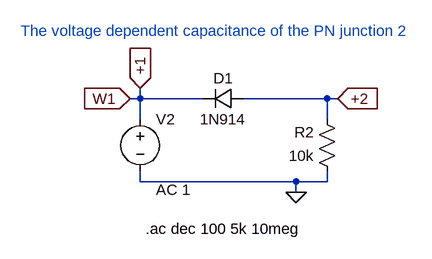
[diagram p0: schematic v_dep_pn2.asc]
v_dep_pn2.asc, the LTspice schematic file:
Version 4
SHEET 1 880 680
WIRE 128 96 128 80
WIRE 128 96 112 96
WIRE 224 96 128 96
WIRE 416 96 288 96
WIRE 432 96 416 96
WIRE 128 128 128 96
WIRE 416 128 416 96
WIRE 128 224 128 208
WIRE 368 224 128 224
WIRE 416 224 416 208
WIRE 416 224 368 224
WIRE 368 240 368 224
FLAG 368 240 0
FLAG 112 96 W1
IOPIN 112 96 In
FLAG 128 80 +1
IOPIN 128 80 In
FLAG 432 96 +2
IOPIN 432 96 In
SYMBOL res 432 224 R180
WINDOW 0 36 76 Left 2
WINDOW 3 36 40 Left 2
SYMATTR InstName R2
SYMATTR Value 10k
SYMBOL voltage 128 112 R0
WINDOW 123 24 124 Left 2
WINDOW 39 0 0 Left 0
SYMATTR Value2 AC 1
SYMATTR InstName V2
SYMATTR Value ""
SYMBOL diode 288 80 R90
WINDOW 0 0 32 VBottom 2
WINDOW 3 32 32 VTop 2
SYMATTR InstName D1
SYMATTR Value 1N914
TEXT 136 296 Left 2 !.ac dec 100 5k 10meg
TEXT -56 -8 Left 2 ;The voltage dependent capacitance of the PN junction 2

The netlist it stands for:
* v_dep_pn2.asc
R2 0 +2 10k
V2 +1 0 AC 1
D1 +2 +1 1N914
.model D D
.lib standard.dio
.ac dec 100 5k 10meg
* The voltage dependent capacitance of the PN junction 2
.backanno
.end